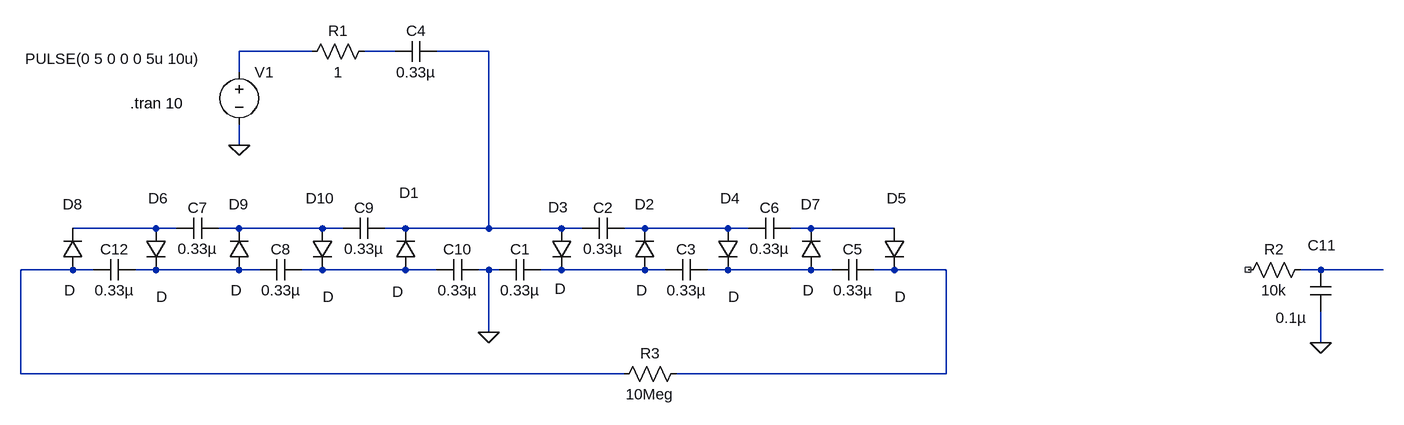
[diagram p0: schematic HiVoltageFeedR.asc]
HiVoltageFeedR.asc, the LTspice schematic file:
Version 4
SHEET 1 1836 680
WIRE -80 -160 -192 -160
WIRE 48 -160 0 -160
WIRE 192 -160 112 -160
WIRE -192 -128 -192 -160
WIRE -192 -16 -192 -48
WIRE -320 112 -448 112
WIRE -288 112 -320 112
WIRE -192 112 -224 112
WIRE -64 112 -192 112
WIRE -32 112 -64 112
WIRE 64 112 32 112
WIRE 192 112 192 -160
WIRE 192 112 64 112
WIRE 304 112 192 112
WIRE 336 112 304 112
WIRE 432 112 400 112
WIRE 560 112 432 112
WIRE 592 112 560 112
WIRE 688 112 656 112
WIRE 816 112 688 112
WIRE -448 176 -528 176
WIRE -416 176 -448 176
WIRE -320 176 -352 176
WIRE -192 176 -320 176
WIRE -160 176 -192 176
WIRE -64 176 -96 176
WIRE 64 176 -64 176
WIRE 112 176 64 176
WIRE 192 176 176 176
WIRE 208 176 192 176
WIRE 304 176 272 176
WIRE 432 176 304 176
WIRE 464 176 432 176
WIRE 560 176 528 176
WIRE 688 176 560 176
WIRE 720 176 688 176
WIRE 816 176 784 176
WIRE 896 176 816 176
WIRE 1472 176 1440 176
WIRE 1568 176 1472 176
WIRE 192 272 192 176
WIRE 1472 288 1472 240
WIRE -528 336 -528 176
WIRE 400 336 -528 336
WIRE 896 336 896 176
WIRE 896 336 480 336
FLAG 192 272 0
FLAG -192 -16 0
FLAG 1472 288 0
SYMBOL diode 80 176 R180
WINDOW 0 -5 119 Left 2
WINDOW 3 19 -34 Left 2
SYMATTR InstName D1
SYMBOL diode 448 176 R180
WINDOW 0 1 101 Left 2
WINDOW 3 12 -31 Left 2
SYMATTR InstName D2
SYMBOL diode 320 112 M0
WINDOW 0 6 -32 Left 2
WINDOW 3 9 93 Left 2
SYMATTR InstName D3
SYMBOL diode 576 112 M0
WINDOW 0 -3 -46 Left 2
WINDOW 3 -2 105 Left 2
SYMATTR InstName D4
SYMBOL cap 272 160 R90
WINDOW 0 0 32 VBottom 2
WINDOW 3 32 32 VTop 2
SYMATTR InstName C1
SYMATTR Value 0.33µ
SYMBOL cap 400 96 R90
WINDOW 0 0 32 VBottom 2
WINDOW 3 32 32 VTop 2
SYMATTR InstName C2
SYMATTR Value 0.33µ
SYMBOL cap 528 160 R90
WINDOW 0 0 32 VBottom 2
WINDOW 3 32 32 VTop 2
SYMATTR InstName C3
SYMATTR Value 0.33µ
SYMBOL cap 112 -176 R90
WINDOW 0 0 32 VBottom 2
WINDOW 3 32 32 VTop 2
SYMATTR InstName C4
SYMATTR Value 0.33µ
SYMBOL voltage -192 -144 R0
WINDOW 3 -329 -5 Left 2
WINDOW 123 0 0 Left 0
WINDOW 39 0 0 Left 0
SYMATTR Value PULSE(0 5 0 0 0 5u 10u)
SYMATTR InstName V1
SYMBOL res 16 -176 R90
WINDOW 0 0 56 VBottom 2
WINDOW 3 32 56 VTop 2
SYMATTR InstName R1
SYMATTR Value 1
SYMBOL diode 832 112 M0
WINDOW 0 -3 -46 Left 2
WINDOW 3 -2 105 Left 2
SYMATTR InstName D5
SYMBOL diode -304 112 M0
WINDOW 0 -3 -46 Left 2
WINDOW 3 -2 105 Left 2
SYMATTR InstName D6
SYMBOL diode 704 176 R180
WINDOW 0 1 101 Left 2
WINDOW 3 12 -31 Left 2
SYMATTR InstName D7
SYMBOL diode -432 176 R180
WINDOW 0 1 101 Left 2
WINDOW 3 12 -31 Left 2
SYMATTR InstName D8
SYMBOL cap 784 160 R90
WINDOW 0 0 32 VBottom 2
WINDOW 3 32 32 VTop 2
SYMATTR InstName C5
SYMATTR Value 0.33µ
SYMBOL cap 656 96 R90
WINDOW 0 0 32 VBottom 2
WINDOW 3 32 32 VTop 2
SYMATTR InstName C6
SYMATTR Value 0.33µ
SYMBOL cap -224 96 R90
WINDOW 0 0 32 VBottom 2
WINDOW 3 32 32 VTop 2
SYMATTR InstName C7
SYMATTR Value 0.33µ
SYMBOL cap -96 160 R90
WINDOW 0 0 32 VBottom 2
WINDOW 3 32 32 VTop 2
SYMATTR InstName C8
SYMATTR Value 0.33µ
SYMBOL cap 32 96 R90
WINDOW 0 0 32 VBottom 2
WINDOW 3 32 32 VTop 2
SYMATTR InstName C9
SYMATTR Value 0.33µ
SYMBOL diode -176 176 R180
WINDOW 0 1 101 Left 2
WINDOW 3 12 -31 Left 2
SYMATTR InstName D9
SYMBOL cap 176 160 R90
WINDOW 0 0 32 VBottom 2
WINDOW 3 32 32 VTop 2
SYMATTR InstName C10
SYMATTR Value 0.33µ
SYMBOL diode -48 112 M0
WINDOW 0 -3 -46 Left 2
WINDOW 3 -2 105 Left 2
SYMATTR InstName D10
SYMBOL res 1456 160 R90
WINDOW 0 0 56 VBottom 2
WINDOW 3 32 56 VTop 2
SYMATTR InstName R2
SYMATTR Value 10k
SYMBOL cap 1488 240 R180
WINDOW 0 -8 102 Left 2
WINDOW 3 38 -10 Left 2
SYMATTR InstName C11
SYMATTR Value 0.1µ
SYMBOL res 496 320 R90
WINDOW 0 0 56 VBottom 2
WINDOW 3 32 56 VTop 2
SYMATTR InstName R3
SYMATTR Value 10Meg
SYMBOL cap -352 160 R90
WINDOW 0 0 32 VBottom 2
WINDOW 3 32 32 VTop 2
SYMATTR InstName C12
SYMATTR Value 0.33µ
TEXT -360 -80 Left 2 !.tran 10

The netlist it stands for:
* HiVoltageFeedR.asc
D1 N010 N003 D
D2 N011 N006 D
D3 N003 N011 D
D4 N006 N012 D
C1 N011 0 0.33µ
C2 N006 N003 0.33µ
C3 N012 N011 0.33µ
C4 N003 N002 0.33µ
V1 N001 0 PULSE(0 5 0 0 0 5u 10u)
R1 N002 N001 1
D5 N007 N013 D
D6 N004 N009 D
D7 N012 N007 D
D8 N008 N004 D
C5 N013 N012 0.33µ
C6 N007 N006 0.33µ
C7 N005 N004 0.33µ
C8 N010 N009 0.33µ
C9 N003 N005 0.33µ
D9 N009 N005 D
C10 0 N010 0.33µ
D10 N005 N010 D
R2 N014 NC_01 10k
C11 0 N014 0.1µ
R3 N013 N008 10Meg
C12 N009 N008 0.33µ
.model D D
.lib standard.dio
.tran 10
.backanno
.end